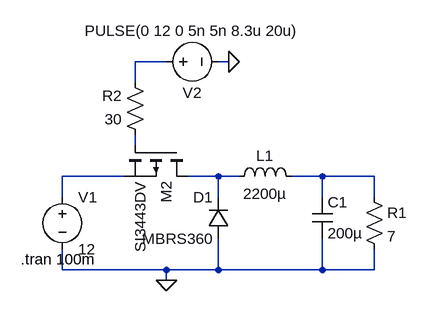
[diagram p0: schematic lab7.asc]
lab7.asc, the LTspice schematic file:
Version 4.1
SHEET 1 880 680
WIRE 320 -80 272 -80
WIRE 416 -80 400 -80
WIRE 272 -48 272 -80
WIRE 272 48 272 32
WIRE 256 96 160 96
WIRE 400 96 352 96
WIRE 432 96 400 96
WIRE 560 96 512 96
WIRE 640 96 560 96
WIRE 160 128 160 96
WIRE 400 128 400 96
WIRE 560 128 560 96
WIRE 640 128 640 96
WIRE 160 240 160 208
WIRE 320 240 160 240
WIRE 400 240 400 192
WIRE 400 240 320 240
WIRE 560 240 560 192
WIRE 560 240 400 240
WIRE 640 240 640 208
WIRE 640 240 560 240
WIRE 320 256 320 240
FLAG 416 -80 0
FLAG 320 256 0
SYMBOL voltage 160 112 R0
SYMATTR InstName V1
SYMATTR Value 12
SYMBOL pmos 352 48 R90
SYMATTR InstName M2
SYMATTR Value SI3443DV
SYMBOL diode 416 192 R180
WINDOW 0 24 64 Left 2
WINDOW 3 24 0 Left 2
SYMATTR InstName D1
SYMATTR Value MBRS360
SYMBOL ind 416 112 R270
WINDOW 0 32 56 VTop 2
WINDOW 3 5 56 VBottom 2
SYMATTR InstName L1
SYMATTR Value 2200µ
SYMATTR SpiceLine Rser=1m
SYMBOL cap 544 128 R0
SYMATTR InstName C1
SYMATTR Value 200µ
SYMBOL res 624 112 R0
SYMATTR InstName R1
SYMATTR Value 7
SYMBOL res 288 48 R180
WINDOW 0 36 76 Left 2
WINDOW 3 36 40 Left 2
SYMATTR InstName R2
SYMATTR Value 30
SYMBOL voltage 304 -80 R270
WINDOW 0 -32 56 VBottom 2
WINDOW 3 32 56 VTop 2
WINDOW 123 0 0 Left 0
WINDOW 39 0 0 Left 0
SYMATTR InstName V2
SYMATTR Value PULSE(0 12 0 5n 5n 8.3u 20u)
TEXT 96 224 Left 2 !.tran 100m

The netlist it stands for:
* lab7.asc
V1 N003 0 12
M2 N004 N002 N003 N003 SI3443DV
D1 0 N004 MBRS360
L1 N004 N005 2200µ Rser=1m
C1 N005 0 200µ
R1 N005 0 7
R2 N002 N001 30
V2 N001 0 PULSE(0 12 0 5n 5n 8.3u 20u)
.model D D
.lib standard.dio
.model NMOS NMOS
.model PMOS PMOS
.lib standard.mos
.tran 100m
.backanno
.end